# EAGLE design plugV6-Relay-NC-1 (EAGLE 7.5.0)
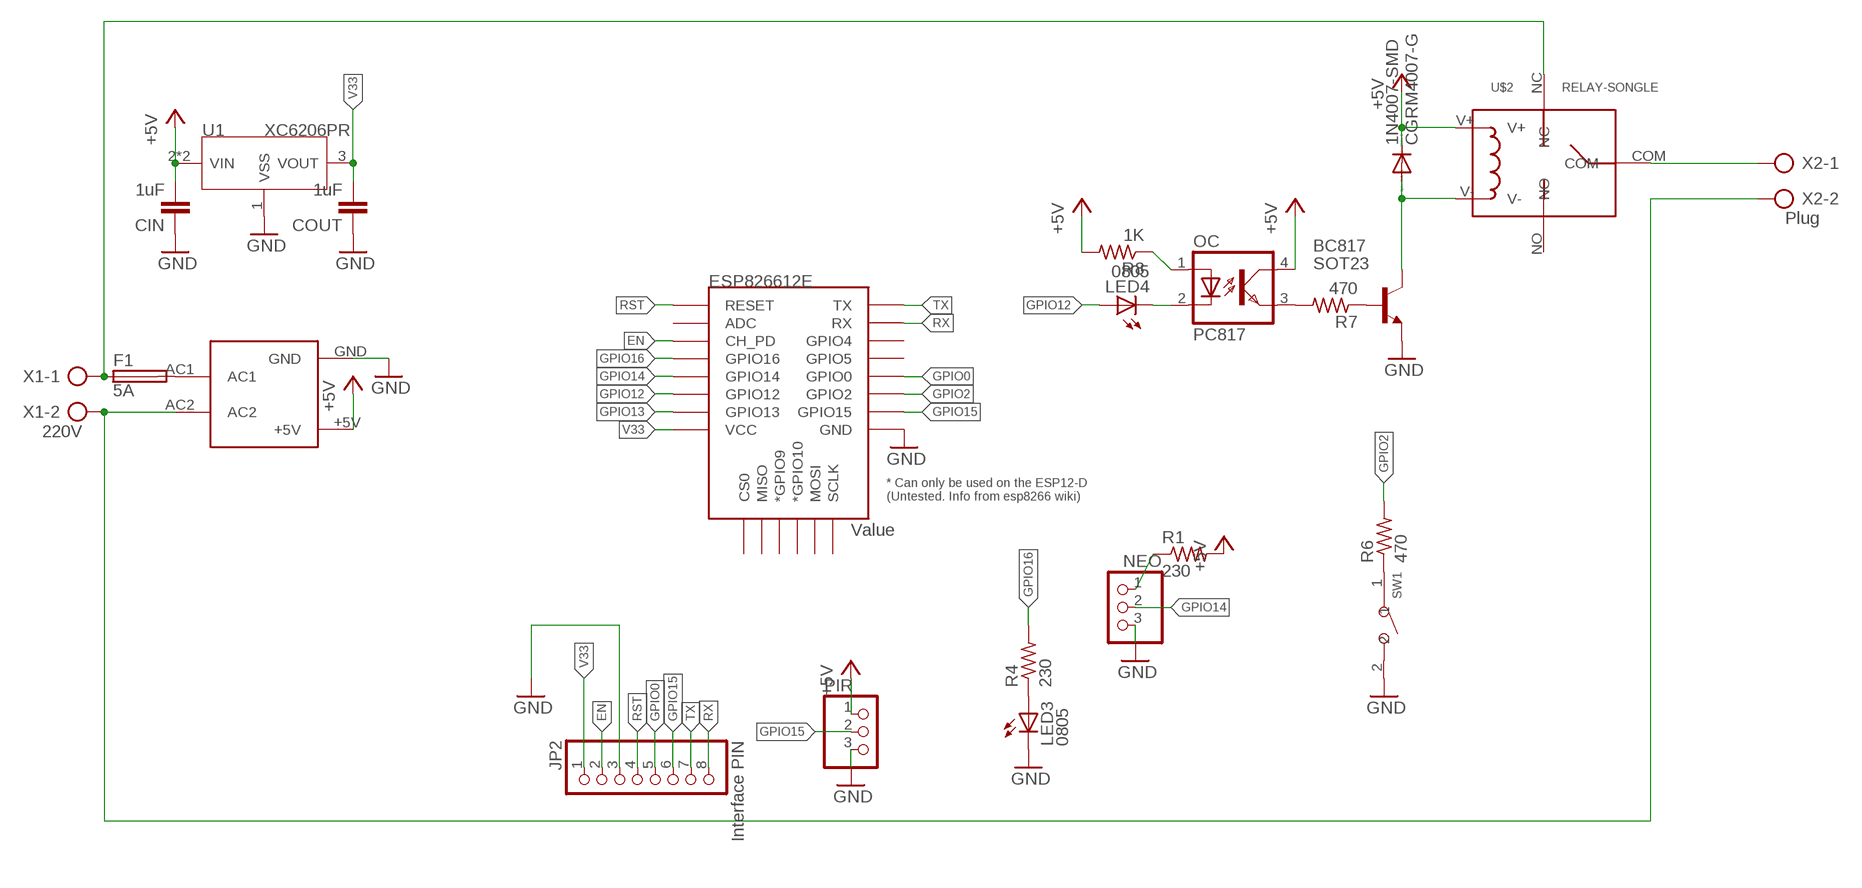
[diagram p0: schematic, sheet 1]

## Parts
1N4007-SMD  CGRM4007-G  [SOD-123_MINI-SMA]
BC817  SOT23  BC817-NPN-SOT23-BEC  [SOT23-BEC]
CIN  1uF  C-EUC0805  [C0805]
COUT  1uF  C-EUC0805  [C0805]
ESP826612E  Value  ESP12ESMD  [ESP12E-SMD]
F1  5A  SH22,5A  [SH22,5A]
JP2  Interface PIN  PINHD-1X8  [1X08]
LED3  0805  LEDCHIP-LED0603  [CHIP-LED0603]
LED4  0805  LEDCHIP-LED0603  [CHIP-LED0603]
NEO  PINHD-1X3  [1X03]
OC  PC817  [DIL04]
PIR  PINHD-1X3  [1X03]
R1  230  R-US_R1206  [R1206]
R4  230  R-US_R1206  [R1206]
R6  470  R-US_R1206  [R1206]
R7  470  R-US_R1206  [R1206]
R8  1K  R-US_R1206  [R1206]
SW1  DIP-BUTTON(2P-6.0X3.0X4.3MM)-TS-1101F  [SW2-5.0-6.0X3.0X4.3MM]
U1  XC6206PR  [SOT89]
U$1  HLK-PM01  [HLK-PM01]
U$2  RELAY-SONGLE  [RELAY-SONGLE]
X1  220V  AK300/2  [AK300/2]
X2  Plug  AK300/2  [AK300/2]

## Nets
+5V: 1N4007-SMD.C CIN.2 OC.4(COL) PIR.1 R1.2 R8.2 U1.2(VIN) U1.4(VIN) U$1.+5V U$2.V+
EN: ESP826612E.CH_PD JP2.2
GND: BC817.E CIN.1 COUT.1 ESP826612E.GND JP2.3 LED3.C NEO.3 PIR.3 SW1.2 U1.1(VSS) U$1.GND
GPIO0: ESP826612E.GPIO0 JP2.5
GPIO2: ESP826612E.GPIO2 R6.2
GPIO12: ESP826612E.GPIO12 LED4.A
GPIO13: ESP826612E.GPIO13
GPIO14: ESP826612E.GPIO14 NEO.2
GPIO15: ESP826612E.GPIO15 JP2.6 PIR.2
GPIO16: ESP826612E.GPIO16 R4.2
N$1: F1.1 U$2.NC X1.1
N$2: F1.2 U$1.AC1
N$3: U$1.AC2 X1.2 X2.2
N$4: U$2.COM X2.1
N$5: OC.3(EMIT) R7.2
N$6: BC817.B R7.1
N$7: R6.1 SW1.1
N$8: LED3.A R4.1
N$9: NEO.1 R1.1
N$13: OC.1(A) R8.1
N$15: LED4.C OC.2(C)
N$18: 1N4007-SMD.A BC817.C U$2.V-
RST: ESP826612E.RESET JP2.4
RX: ESP826612E.RXD0(RX) JP2.8
TX: ESP826612E.TXD0(TX) JP2.7
V33: COUT.2 ESP826612E.VCC JP2.1 U1.3(VOUT)
Unconnected: ESP826612E.ADC ESP826612E.CS0 ESP826612E.GPIO4 ESP826612E.GPIO5 ESP826612E.GPIO9(*GPIO9) ESP826612E.GPIO10(*GPIO10) ESP826612E.MISO ESP826612E.MOSI ESP826612E.SCLK U$2.NO

## Library data of the parts
1N4007-SMD = diode:CGRM400*-G: Molded plasitc,JEDEC SOD-123/Mini SMA Source: Comchip CGRM4001-G.pdf
BC817 = transistor-neu-to92:*-NPN-: NPN Transistror
CIN COUT = rcl:C-EU: CAPACITOR, European symbol
ESP826612E = esp8266modules:ESP12E: ESP12E Module
F1 = fuse:SH22,5A: FUSE HOLDER grid 22,5mm, isolated cap OGN0031 8201, Schurter (Buerklin); MPN: 0031.7701.11; OC_FARNELL: unknown; OC_NEWARK: 04F1224
JP2 = pinhead:PINHD-1X8: PIN HEADER
LED3 LED4 = led:LED: LED OSRAM: - CHIPLED LG R971, LG N971, LY N971, LG Q971, LY Q971, LO R971, LY R971 LH N974, LH R974 LS Q976, LO Q976, LY Q976 LO Q996 - Hyper CHIPLED LW Q18S LB Q993, LB Q99A, LB R99A - SideLED LS A670, LO A670, LY A670, LG A670, LP A670 LB A673, LV A673, LT A673, LW A673 LH A674 LY A675 LS A676, LA A676, LO A676, LY A676, LW A676 LS A679, LY A679, LG A679 - Hyper Micro SIDELED® LS Y876, LA Y876, LO Y876, LY Y876 LT Y87S - SmartLED LW L88C, LW L88S LB L89C, LB L89S, LG L890 LS L89K, LO L89K, LY L89K LS L896, LA L896, LO L896, LY L896 - TOPLED LS T670, LO T670, LY T670, LG T670, LP T670 LSG T670, LSP T670, LSY T670, LOP T670, LYG T670 LG T671, LOG T671, LSG T671 LB T673, LV T673, LT T673, LW T673 LH T674 LS T676, LA T676, LO T676, LY T676, LB T676, LH T676, LSB T676, LW T676 LB T67C, LV T67C, LT T67C, LS T67K, LO T67K, LY T67K, LW E67C LS E67B, LA E67B, LO E67B, LY E67B, LB E67C, LV E67C, LT E67C LW T67C LS T679, LY T679, LG T679 LS T770, LO T770, LY T770, LG T770, LP T770 LB T773, LV T773, LT T773, LW T773 LH T774 LS E675, LA E675, LY E675, LS T675 LS T776, LA T776, LO T776, LY T776, LB T776 LHGB T686 LT T68C, LB T68C - Hyper Mini TOPLED® LB M676 - Mini TOPLED Santana® LG M470 LS M47K, LO M47K, LY M47K Source: http://www.osram.convergy.de LUXEON: - LUMILED® LXK2-PW12-R00, LXK2-PW12-S00, LXK2-PW14-U00, LXK2-PW14-V00 LXK2-PM12-R00, LXK2-PM12-S00, LXK2-PM14-U00 LXK2-PE12-Q00, LXK2-PE12-R00, LXK2-PE12-S00, LXK2-PE14-T00, LXK2-PE14-U00 LXK2-PB12-K00, LXK2-PB12-L00, LXK2-PB12-M00, LXK2-PB14-N00, LXK2-PB14-P00, LXK2-PB14-Q00 LXK2-PR12-L00, LXK2-PR12-M00, LXK2-PR14-Q00, LXK2-PR14-R00 LXK2-PD12-Q00, LXK2-PD12-R00, LXK2-PD12-S00 LXK2-PH12-R00, LXK2-PH12-S00 LXK2-PL12-P00, LXK2-PL12-Q00, LXK2-PL12-R00 Source: www.luxeon.com KINGBRIGHT: KA-3528ASYC Source: www.kingbright.com
NEO PIR = pinhead:PINHD-1X3: PIN HEADER
OC = optocoupler:PC817: SHARP OPTO COUPLER; MPN: PC817X4J000F; OC_FARNELL: 9707727; OC_NEWARK: 97K7059
R1 R4 R6-R8 = rcl:R-US_: RESISTOR, American symbol
SW1 = Seeed-OPL-Switch:DIP-BUTTON(2P-6.0X3.0X4.3MM): 311020025
U1 = IC:XC6206: LOW ESR Cap.Compatible Positive Voltage Regulators
U$1 = HLK-PM01:HLK-PM01
U$2 = Seeed-OPL-Relay:RELAY-SONGLE
X1 X2 = con-ptr500:AK300/2: CONNECTOR; OC_FARNELL: unknown; OC_NEWARK: unknown

## Board
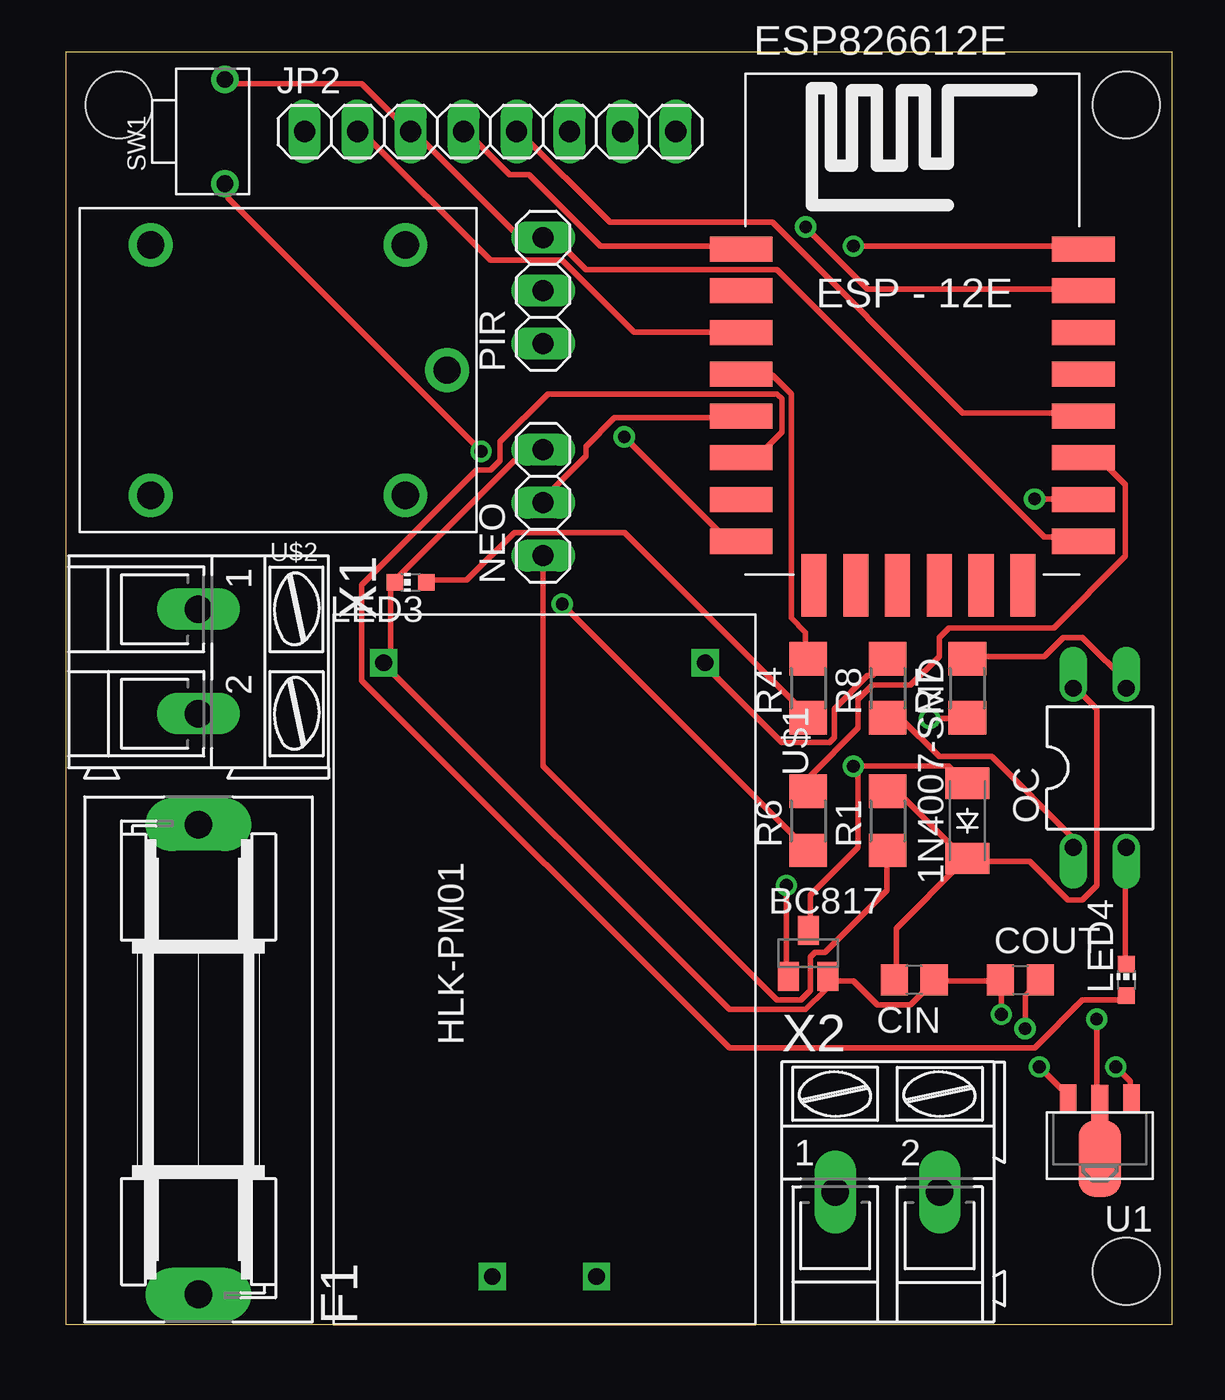
[diagram p1: board, top side]
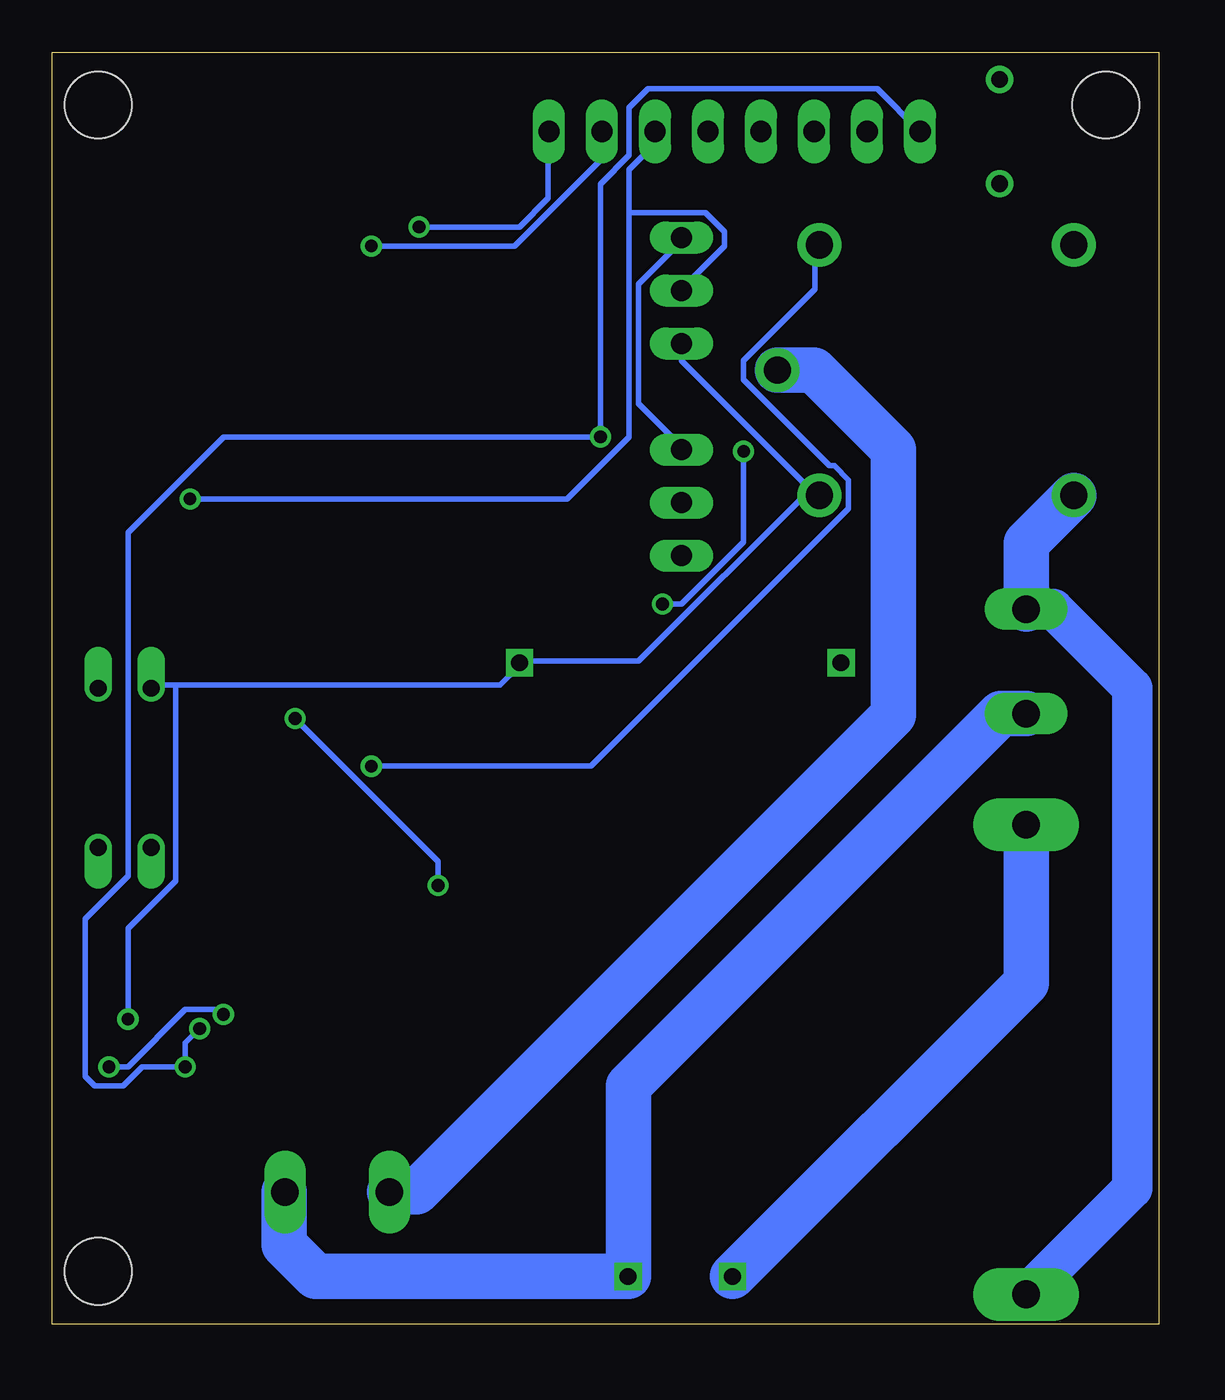
[diagram p2: board, bottom side, seen from below]

Size 53.01 x 60.95 mm. Coordinates in mm from the lower left corner, seen from the top.
Outline: 0,0 53.01,0 53.01,60.95 0,60.95 0,0
Copper layers (1*16): Top 0.035mm / dielectric 1.5mm / Bottom 0.035mm
Design rules "default": minimum track width 10mil, minimum drill 24mil, track to track 8mil, track to pad 8mil, pad to pad 8mil, via to via 8mil, smd to smd 8mil, copper to edge 40mil, drill to drill 8mil, minimum pad ring 10mil, minimum via ring 8mil, stop-mask expansion 4mil, vias tented up to drill 0mil, thermal gap 10mil
Holes 3.2 mm at 50.8,58.42 50.8,2.54 2.54,58.42

### Footprints (pad centres in the part's own frame; a part is rotated, then mirrored left to right if it is on the bottom)
SOD-123_MINI-SMA = smd 1.5 x 2.1: A 1.8,0; C -1.8,0
SOT23-BEC = smd 1 x 1.4: B -0.95,-1.1; C 0,1.1; E 0.95,-1.1
C0805 = smd 1.3 x 1.5: 1 -0.95,0; 2 0.95,0
ESP12E-SMD = smd 3 x 1.2: ADC -8.3,3.8; CH_PD -8.3,1.8; GND 8.1,-8.2; GPIO0 8.1,-2.2; GPIO2 8.1,-4.2; GPIO4 8.1,-0.2; GPIO5 8.1,1.8; GPIO12 -8.3,-4.2; GPIO13 -8.3,-6.2; GPIO14 -8.3,-2.2; GPIO15 8.1,-6.2; GPIO16 -8.3,-0.2; RESET -8.3,5.8; RXD0 8.1,3.8; TXD0 8.1,5.8; VCC -8.3,-8.2 | smd 1.2 x 3: CS0 -4.8,-10.3; GPIO9 -0.8,-10.3; GPIO10 1.2,-10.3; MISO -2.8,-10.3; MOSI 3.2,-10.3; SCLK 5.2,-10.3
SH22,5A = drill 1.321 pad 2.54 long: 1 -11.252,0; 2 11.252,0
1X08 = drill 1.016 long: 1 -8.89,0; 2 -6.35,0; 3 -3.81,0; 4 -1.27,0; 5 1.27,0; 6 3.81,0; 7 6.35,0; 8 8.89,0
CHIP-LED0603 = smd 0.8 x 0.8: A 0,-0.75; C 0,0.75
1X03 = drill 1.016 long: 1 -2.54,0; 2 0,0; 3 2.54,0
DIL04 = drill 0.813 offset: 1 -1.27,-3.81; 2 1.27,-3.81; 3 1.27,3.81; 4 -1.27,3.81
R1206 = smd 1.6 x 1.803: 1 -1.422,0; 2 1.422,0
SW2-5.0-6.0X3.0X4.3MM = drill 0.8 pad 1.27: 1 -2.5,0; 2 2.5,0
SOT89 = smd 0.8 x 1.4: 1 -1.524,-1.905; 3 1.524,-1.905 | smd 0.8 x 1.9: 2 0,-1.651 | smd 2.032 x 3.65: 4 0,0.94
HLK-PM01 = drill 0.8 square: +5V 15.19,-7.76; AC1 -14.21,2.44; AC2 -14.21,-2.56; GND 15.19,7.64
RELAY-SONGLE = drill 1.3 pad 2.1: COM -8.1,0; NC 6.1,6; NO 6.1,-6; V+ -6.1,6; V- -6.1,-6
AK300/2 = drill 1.321 long: 1 -2.515,0; 2 2.489,0

### Placement (x,y rotation side)
1N4007-SMD  43.18,24.13 90 top
BC817  35.56,17.78 0 top
CIN  40.64,16.51 180 top
COUT  45.72,16.51 0 top
ESP826612E  40.64,45.72 0 top
F1  6.35,12.7 90 top
JP2  20.32,57.15 0 top
LED3  16.51,35.56 90 top
LED4  50.8,16.51 0 top
NEO  22.86,39.37 90 top
OC  49.53,26.67 0 top
PIR  22.86,49.53 90 top
R1  39.37,24.13 90 top
R4  35.56,30.48 90 top
R6  35.56,24.13 90 top
R7  43.18,30.48 90 top
R8  39.37,30.48 90 top
SW1  7.62,57.15 90 top
U1  49.53,8.89 180 top
U$1  22.86,16.51 90 top
U$2  10.16,45.72 180 top
X1  6.35,31.75 270 top
X2  39.37,6.35 0 top

### Tracks (layer width: path | path; a pad name or v marks a point on that pad's centre or on a via)
+5V  (via drill 0.61)
  Top 0.254: CIN.2 39.78,16.69 39.78,18.97 42.98,22.17 1N4007-SMD.C | R1.2 39.55,25.38 40.01,25.38 42.98,22.4 1N4007-SMD.C | U1.4 49.61,8 49.61,10.52 U1.2 49.38,10.74 v49.38,14.63 | R8.2 39.32,31.77 38.63,31.09 38.41,31.09 36.8,29.49 36.8,28.12 36.58,27.89 34.29,27.89 30.63,31.55 U$1.+5V | 1N4007-SMD.C 43.2,22.17 46.18,22.17 48.01,20.34 48.69,20.34 49.38,21.03 49.38,29.49 48.46,30.4 OC.4
  Bottom 0.254: PIR.1 22.86,46.18 16.69,40.01 | 16.69,40.01 16.46,39.78 U$2.V+ 16.69,40.01 | 47.09,30.63 31.55,30.63 30.63,31.55 U$1.+5V 30.4,31.77 24.92,31.77 16.69,40.01 | 47.09,30.63 48.23,30.63 OC.4 | v49.38,14.63 49.38,18.97 47.09,21.26 47.09,30.63
EN
  Top 0.254: ESP826612E.CH_PD 32.23,47.55 27.2,47.55 23.77,50.98 20.34,50.98 14.17,57.15 JP2.2
GND  (via drill 0.61)
  Top 0.254: SW1.2 7.77,59.44 14.17,59.44 16.46,57.15 JP2.3 16.69,57.15 21.72,52.12 22.86,52.12 PIR.3 22.86,51.89 23.55,51.89 24.92,50.52 34.06,50.52 46.86,37.72 48.69,37.72 ESP826612E.GND | 41.6,16.46 40.46,15.32 38.86,15.32 37.72,16.46 36.58,16.46 BC817.E 36.35,16.46 36.35,16 35.43,15.09 31.77,15.09 15.32,31.55 U$1.GND 15.32,31.77 15.54,32 15.54,35.43 LED3.C 15.77,35.66 21.95,41.83 22.86,41.83 NEO.3 | v50.29,12.34 50.98,11.66 50.98,10.97 U1.1 | v44.81,14.86 44.81,16.46 COUT.1 44.58,16.46 41.6,16.46 | 41.6,16.46 CIN.1
  Bottom 0.254: v50.29,12.34 49.38,12.34 46.63,15.09 45.03,15.09 v44.81,14.86 | PIR.3 22.86,51.89 24.92,49.84 24.92,44.12 22.86,42.06 NEO.3
GPIO0
  Top 0.254: ESP826612E.GPIO0 48.69,43.66 42.98,43.66 33.83,52.81 26.06,52.81 21.72,57.15 JP2.5
GPIO2
  Top 0.254: R6.2 35.66,25.6 35.66,26.29 37.95,28.57 37.95,29.95 38.63,30.63 40.46,30.63 41.83,32 41.83,32.92 42.29,33.38 47.32,33.38 50.75,36.8 50.75,40.23 49.61,41.38 48.92,41.38 ESP826612E.GPIO2
GPIO12
  Top 0.254: LED4.A 50.75,15.54 48.69,15.54 46.41,13.26 31.77,13.26 14.17,30.86 14.17,35.43 19.66,40.92 20.34,40.92 20.8,41.38 20.8,42.29 23.09,44.58 34.06,44.58 34.29,44.35 34.29,42.75 33.15,41.6 32.46,41.6 ESP826612E.GPIO12
GPIO14
  Top 0.254: ESP826612E.GPIO14 32.23,43.43 26.29,43.43 24.92,42.06 24.92,41.6 22.86,39.55 NEO.2
GPIO15  (via drill 0.61)
  Top 0.254: v46.41,39.55 48.69,39.55 ESP826612E.GPIO15
  Bottom 0.254: v46.41,39.55 28.35,39.55 25.38,42.52 25.38,53.26 | 25.38,53.26 25.38,55.32 24.23,56.46 24.23,57.15 JP2.6 | 25.38,53.26 21.72,53.26 20.8,52.35 20.8,51.66 22.86,49.61 PIR.2
GPIO16
  Top 0.254: R4.2 35.43,32 35.43,33.15 34.75,33.83 34.75,44.58 33.83,45.49 32.46,45.49 ESP826612E.GPIO16
N$1
  Bottom 1.93: X1.1 5.05,34.27 1.27,30.48 1.27,6.53 F1.1
  Bottom 2.184: X1.1 6.35,37.43 U$2.NC
N$2
  Bottom 2.184: F1.2 6.35,16.37 U$1.AC1
N$3
  Bottom 0.254: X2.2 41.83,6.4 41.91,6.35
  Bottom 2.184: 41.91,6.35 41.91,3.81 40.4,2.3 U$1.AC2 25.4,2.32 25.4,11.43 7.57,29.26 X1.2
N$4
  Bottom 2.184: U$2.COM 16.51,45.72 12.7,41.91 12.7,29.21 35.56,6.35 X2.1
N$5
  Top 0.254: R7.2 43.2,32 46.86,32 47.78,32.92 48.69,32.92 50.98,30.63 OC.3
N$6  (via drill 0.61)
  Top 0.254: v34.52,21.03 34.52,16.69 BC817.B | v41.38,29.03 42.98,29.03 R7.1
  Bottom 0.254: v34.52,21.03 34.52,22.17 v41.38,29.03
N$7  (via drill 0.61)
  Top 0.254: v23.77,34.52 35.43,22.86 R6.1 | v19.89,41.83 7.77,53.95 7.77,54.63 SW1.1
  Bottom 0.254: v23.77,34.52 22.86,34.52 19.89,37.49 v19.89,41.83
N$8
  Top 0.254: LED3.A 17.37,35.66 19.2,35.66 21.49,37.95 26.75,37.95 35.43,29.26 R4.1
N$9
  Top 0.254: NEO.1 22.86,26.75 34.06,15.54 35.2,15.54 35.66,16 35.66,17.6 35.89,17.83 36.35,17.83 39.32,20.8 39.32,22.63 R1.1
N$13
  Top 0.254: R8.1 39.55,29.03 40.01,29.03 41.83,27.2 44.35,27.2 48.23,23.32 48.23,22.86 OC.1
N$15
  Top 0.254: LED4.C 50.75,17.37 50.75,22.86 OC.2
N$18  (via drill 0.61)
  Top 0.254: 37.95,26.52 37.95,22.86 35.66,20.57 35.66,18.97 BC817.C | 37.95,26.52 38.18,26.75 42.29,26.75 42.98,26.06 1N4007-SMD.A | 37.95,26.52 v37.72,26.75
  Bottom 0.254: v37.72,26.75 27.2,26.75 14.86,39.09 14.86,40.46 15.54,41.15 15.77,41.15 19.89,45.26 19.89,46.18 16.46,49.61 16.46,51.66 U$2.V-
RST
  Top 0.254: ESP826612E.RESET 32.23,51.66 25.6,51.66 22.17,55.09 21.26,55.09 19.2,57.15 JP2.4
RX  (via drill 0.61)
  Top 0.254: v35.43,52.58 38.41,49.61 48.69,49.61 ESP826612E.RXD0
  Bottom 0.254: v35.43,52.58 30.63,52.58 29.26,53.95 29.26,57.15 JP2.8
TX  (via drill 0.61)
  Top 0.254: v37.72,51.66 48.69,51.66 ESP826612E.TXD0
  Bottom 0.254: v37.72,51.66 30.86,51.66 26.75,55.78 26.75,57.15 JP2.7
V33  (via drill 0.61)
  Top 0.254: v46.63,12.34 48.01,10.97 U1.3 | v45.95,14.17 45.95,15.77 46.63,16.46 COUT.2 | v26.75,42.52 31.55,37.72 32.23,37.72 ESP826612E.VCC
  Bottom 0.254: v45.95,14.17 46.63,13.49 v46.63,12.34 48.69,12.34 49.61,11.43 50.98,11.43 51.44,11.89 51.44,19.43 49.38,21.49 49.38,37.95 44.81,42.52 v26.75,42.52 26.75,54.63 25.38,56.01 25.38,58.29 24.46,59.21 13.49,59.21 JP2.1